# EAGLE design boxcar-v4a (EAGLE 5.10)
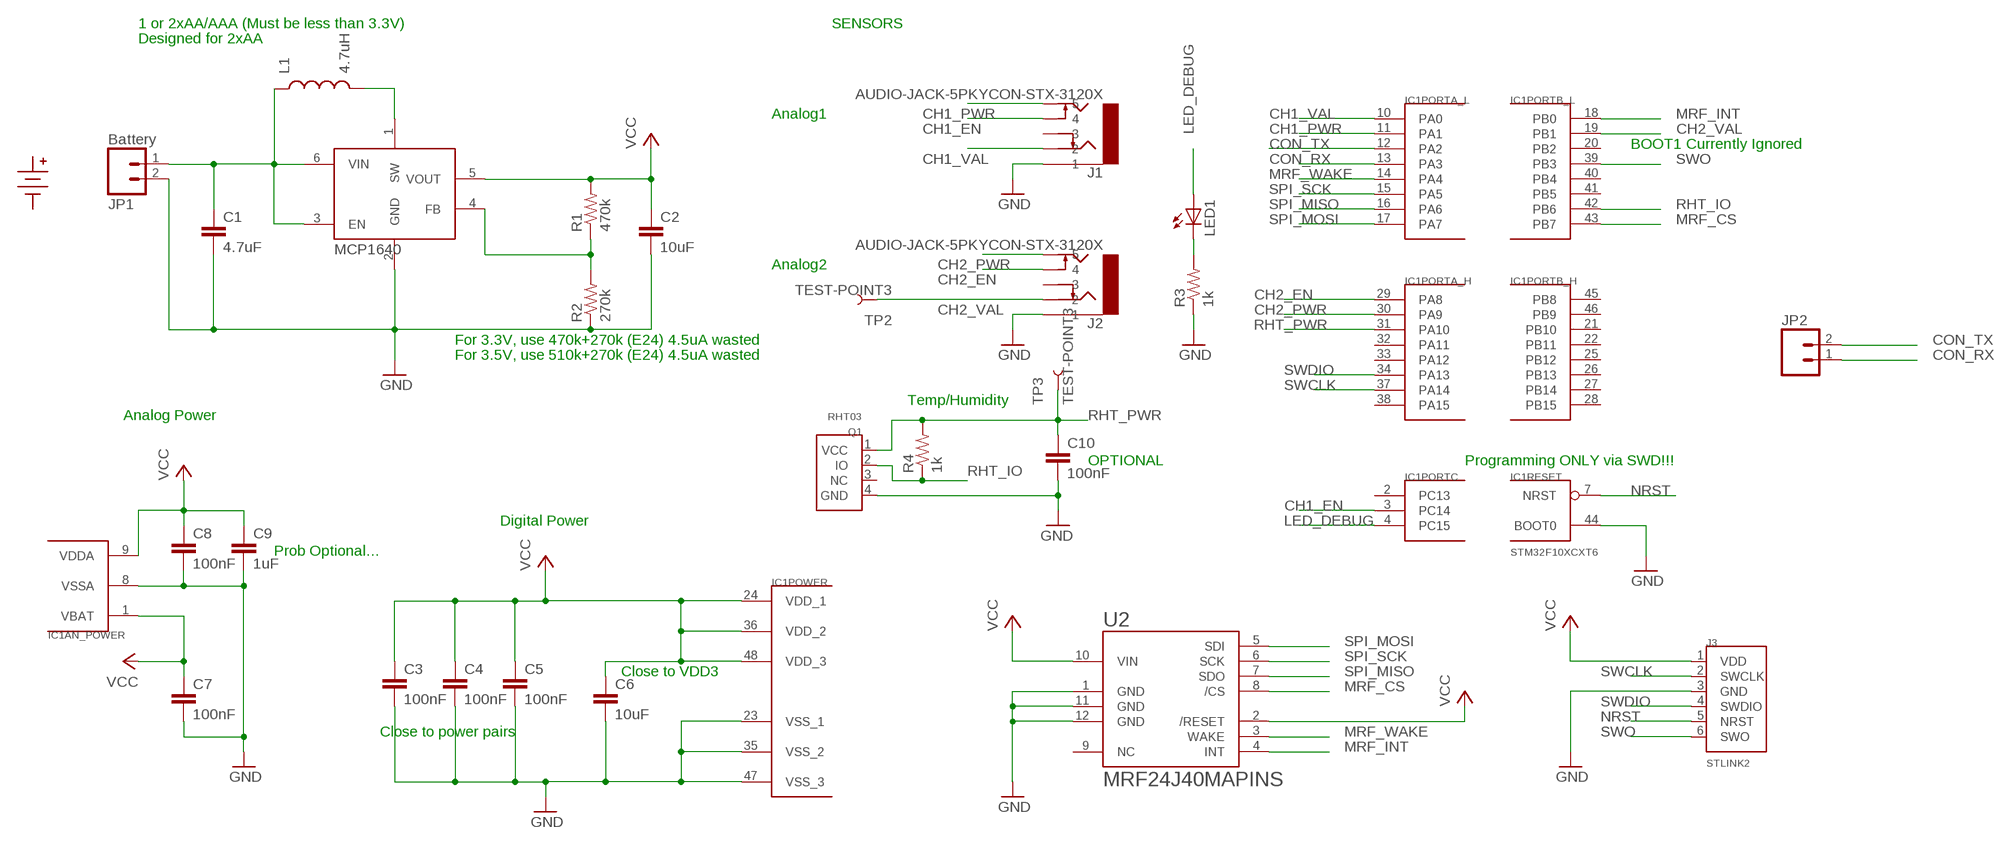
[diagram p0: schematic, sheet 1]

## Parts
C1  4.7uF  CAP0805  [0805]
C2  10uF  CAP0805  [0805]
C3  100nF  CAP0805  [0805]
C4  100nF  CAP0805  [0805]
C5  100nF  CAP0805  [0805]
C6  10uF  CAP0805  [0805]
C7  100nF  CAP0805  [0805]
C8  100nF  CAP0805  [0805]
C9  1uF  CAP0805  [0805]
C10  100nF  CAP0805  [0805]
IC1  STM32F10XCXT6  [TQFP48]
J1  AUDIO-JACK-5PKYCON-STX-3120X  [KYCON-STX-3120X]
J2  AUDIO-JACK-5PKYCON-STX-3120X  [KYCON-STX-3120X]
J3  STLINK2  [STLINK2]
JP1  Battery  M02PTH  [1X02]
JP2  M02PTH  [1X02]
L1  4.7uH  INDUCTOR0805  [0805]
LED1  LEDCHIPLED_0805  [CHIPLED_0805]
Q1  RHT03  [RHT03]
R1  470k  RESISTOR0805-RES  [0805]
R2  270k  RESISTOR0805-RES  [0805]
R3  1k  RESISTOR0805-RES  [0805]
R4  1k  RESISTOR0805-RES  [0805]
TP2  TEST-POINT3  [PAD.03X.03]
TP3  TEST-POINT3  [PAD.03X.03]
U1  MCP1640  [SOT23-6]
U2  MRF24J40MAPINS  [MRF24J40MA]
U$1  BATTERY_LEADS  [KEYSTONE-2463]

## Nets
BAT+: C1.1 JP1.1 L1.1 U1.3(EN) U1.6(VIN)
CH1_EN: IC1.3(PORTC:PC14) J1.4
CH1_PWR: IC1.11(PORTA_L:PA1) J1.5
CH1_VAL: IC1.10(PORTA_L:PA0) J1.2
CH2_EN: IC1.29(PORTA_H:PA8) J2.4
CH2_PWR: IC1.30(PORTA_H:PA9) J2.5
CH2_VAL: IC1.19(PORTB_L:PB1) J2.2 TP2.P$1
CON_RX: IC1.13(PORTA_L:PA3) JP2.1
CON_TX: IC1.12(PORTA_L:PA2) JP2.2
GND: C1.2 C2.2 C3.2 C4.2 C5.2 C6.2 C7.2 C8.2 C9.2 C10.2 IC1.8(AN_POWER:VSSA) IC1.23(POWER:VSS_1) IC1.35(POWER:VSS_2) IC1.44(RESET:BOOT0) IC1.47(POWER:VSS_3) J1.1 J2.1 J3.3(GND) JP1.2 Q1.4(GND) R2.1 R3.1 U1.2(GND) U2.1(GND) U2.11(GND) U2.12(GND)
LED_DEBUG: IC1.4(PORTC:PC15) LED1.A
MRF_CS: IC1.43(PORTB_L:PB7) U2.8(/CS)
MRF_INT: IC1.18(PORTB_L:PB0) U2.4(INT)
MRF_WAKE: IC1.14(PORTA_L:PA4) U2.3(WAKE)
N$1: L1.2 U1.1(SW)
N$3: LED1.C R3.2
N$4: R1.1 R2.2 U1.4(FB)
NRST: IC1.7(RESET:NRST) J3.5(NRST)
RHT_IO: IC1.42(PORTB_L:PB6) Q1.2(IO) R4.1
RHT_PWR: C10.1 IC1.31(PORTA_H:PA10) Q1.1(VCC) R4.2 TP3.P$1
SPI_MISO: IC1.16(PORTA_L:PA6) U2.7(SDO)
SPI_MOSI: IC1.17(PORTA_L:PA7) U2.5(SDI)
SPI_SCK: IC1.15(PORTA_L:PA5) U2.6(SCK)
SWCLK: IC1.37(PORTA_H:PA14) J3.2(SWCLK)
SWDIO: IC1.34(PORTA_H:PA13) J3.4(SWDIO)
SWO: IC1.39(PORTB_L:PB3) J3.6(SWO)
VCC: C2.1 C3.1 C4.1 C5.1 C6.1 C7.1 C8.1 C9.1 IC1.1(AN_POWER:VBAT) IC1.9(AN_POWER:VDDA) IC1.24(POWER:VDD_1) IC1.36(POWER:VDD_2) IC1.48(POWER:VDD_3) J3.1(VDD) R1.2 U1.5(VOUT) U2.2(/RESET) U2.10(VIN)
Unconnected: IC1.2(PORTC:PC13) IC1.5(PORTD/OSC:PD0/OSC<=) IC1.6(PORTD/OSC:PD1/OSC=>) IC1.20(PORTB_L:PB2) IC1.21(PORTB_H:PB10) IC1.22(PORTB_H:PB11) IC1.25(PORTB_H:PB12) IC1.26(PORTB_H:PB13) IC1.27(PORTB_H:PB14) IC1.28(PORTB_H:PB15) IC1.32(PORTA_H:PA11) IC1.33(PORTA_H:PA12) IC1.38(PORTA_H:PA15) IC1.40(PORTB_L:PB4) IC1.41(PORTB_L:PB5) IC1.45(PORTB_H:PB8) IC1.46(PORTB_H:PB9) J1.3 J2.3 Q1.3(NC) U2.9(NC)

## Notes on the sheet
- 1 or 2xAA/AAA (Must be less than 3.3V) | SENSORS
- Designed for 2xAA
- Analog1
- BOOT1 Currently Ignored
- Analog2
- For 3.3V, use 470k+270k (E24) 4.5uA wasted
- For 3.5V, use 510k+270k (E24) 4.5uA wasted
- Temp/Humidity
- Analog Power
- OPTIONAL | Programming ONLY via SWD!!!
- Digital Power
- Prob Optional...
- Close to VDD3
- Close to power pairs

## Library data of the parts
C1-C10 = SparkFun:CAP: Capacitor Standard 0603 ceramic capacitor, and 0.1" leaded capacitor.
IC1 = stm32:STM32F10XCXT6: ST STM32F101/103 48pin LQFP
J1 J2 = karlnet-parts:AUDIO-JACK-5P: Stereo Audio Jack, with switches for each signal contact
J3 = karlnet-parts:STLINK2: STLink/v2 connector 6 pin inline header for SWD, as used on STM32 Discovery boards. (Except the 32VL discovery board, which only has the top 4 pins)
JP1 JP2 = SparkFun:M02: Header 2 Standard 2-pin 0.1" header. Use with straight break away headers (SKU : PRT-00116), right angle break away headers (PRT-00553), swiss pins (PRT-00743), machine pins (PRT-00117), and female headers (PRT-00115). Molex polarized connector foot print use with SKU : PRT-08233 with associated crimp pins and housings.
L1 = SparkFun:INDUCTOR: Inductors Basic Inductor/Choke - 0603 and 1206. Footprints are not proven and vary greatly between part numbers.
LED1 = led:LED: LED OSRAM: - CHIPLED LG R971, LG N971, LY N971, LG Q971, LY Q971, LO R971, LY R971 LH N974, LH R974 LS Q976, LO Q976, LY Q976 LO Q996 - Hyper CHIPLED LW Q18S LB Q993, LB Q99A, LB R99A - SideLED LS A670, LO A670, LY A670, LG A670, LP A670 LB A673, LV A673, LT A673, LW A673 LH A674 LY A675 LS A676, LA A676, LO A676, LY A676, LW A676 LS A679, LY A679, LG A679 - Hyper Micro SIDELED® LS Y876, LA Y876, LO Y876, LY Y876 LT Y87S - SmartLED LW L88C, LW L88S LB L89C, LB L89S, LG L890 LS L89K, LO L89K, LY L89K LS L896, LA L896, LO L896, LY L896 - TOPLED LS T670, LO T670, LY T670, LG T670, LP T670 LSG T670, LSP T670, LSY T670, LOP T670, LYG T670 LG T671, LOG T671, LSG T671 LB T673, LV T673, LT T673, LW T673 LH T674 LS T676, LA T676, LO T676, LY T676, LB T676, LH T676, LSB T676, LW T676 LB T67C, LV T67C, LT T67C, LS T67K, LO T67K, LY T67K, LW E67C LS E67B, LA E67B, LO E67B, LY E67B, LB E67C, LV E67C, LT E67C LW T67C LS T679, LY T679, LG T679 LS T770, LO T770, LY T770, LG T770, LP T770 LB T773, LV T773, LT T773, LW T773 LH T774 LS E675, LA E675, LY E675, LS T675 LS T776, LA T776, LO T776, LY T776, LB T776 LHGB T686 LT T68C, LB T68C - Hyper Mini TOPLED® LB M676 - Mini TOPLED Santana® LG M470 LS M47K, LO M47K, LY M47K Source: http://www.osram.convergy.de LUXEON: - LUMILED® LXK2-PW12-R00, LXK2-PW12-S00, LXK2-PW14-U00, LXK2-PW14-V00 LXK2-PM12-R00, LXK2-PM12-S00, LXK2-PM14-U00 LXK2-PE12-Q00, LXK2-PE12-R00, LXK2-PE12-S00, LXK2-PE14-T00, LXK2-PE14-U00 LXK2-PB12-K00, LXK2-PB12-L00, LXK2-PB12-M00, LXK2-PB14-N00, LXK2-PB14-P00, LXK2-PB14-Q00 LXK2-PR12-L00, LXK2-PR12-M00, LXK2-PR14-Q00, LXK2-PR14-R00 LXK2-PD12-Q00, LXK2-PD12-R00, LXK2-PD12-S00 LXK2-PH12-R00, LXK2-PH12-S00 LXK2-PL12-P00, LXK2-PL12-Q00, LXK2-PL12-R00 Source: www.luxeon.com KINGBRIGHT: KA-3528ASYC Source: www.kingbright.com
Q1 = karlnet-parts:RHT03: RHT03 Temperature/Humidity sensor Also known as DHT22 and AM2302 Utilises a proprietary single pin interface. Occasionally reported to have pin 3 and 4 swapped (NC and ground) See also Sparkfun product page <http://www.sparkfun.com/products/10167>
R1-R4 = SparkFun:RESISTOR: Resistor Basic schematic elements and footprints for 0603, 1206, and PTH resistors.
TP2 TP3 = SparkFun:TEST-POINT
U1 = karlnet-parts:MCP1640: MCP1623, 1624, 1640/B/C/D pwm/pfm or pwm only DC/DC converters, in SOT-23
U2 = karlnet-parts:MRF24J40MA: MRF24J40MA module, 802.15.4 from microchip.
U$1 = karlnet-parts:BATTERY_LEADS: Battery holders with leads, ie, mechanical placement only, no electrical connections

## Board
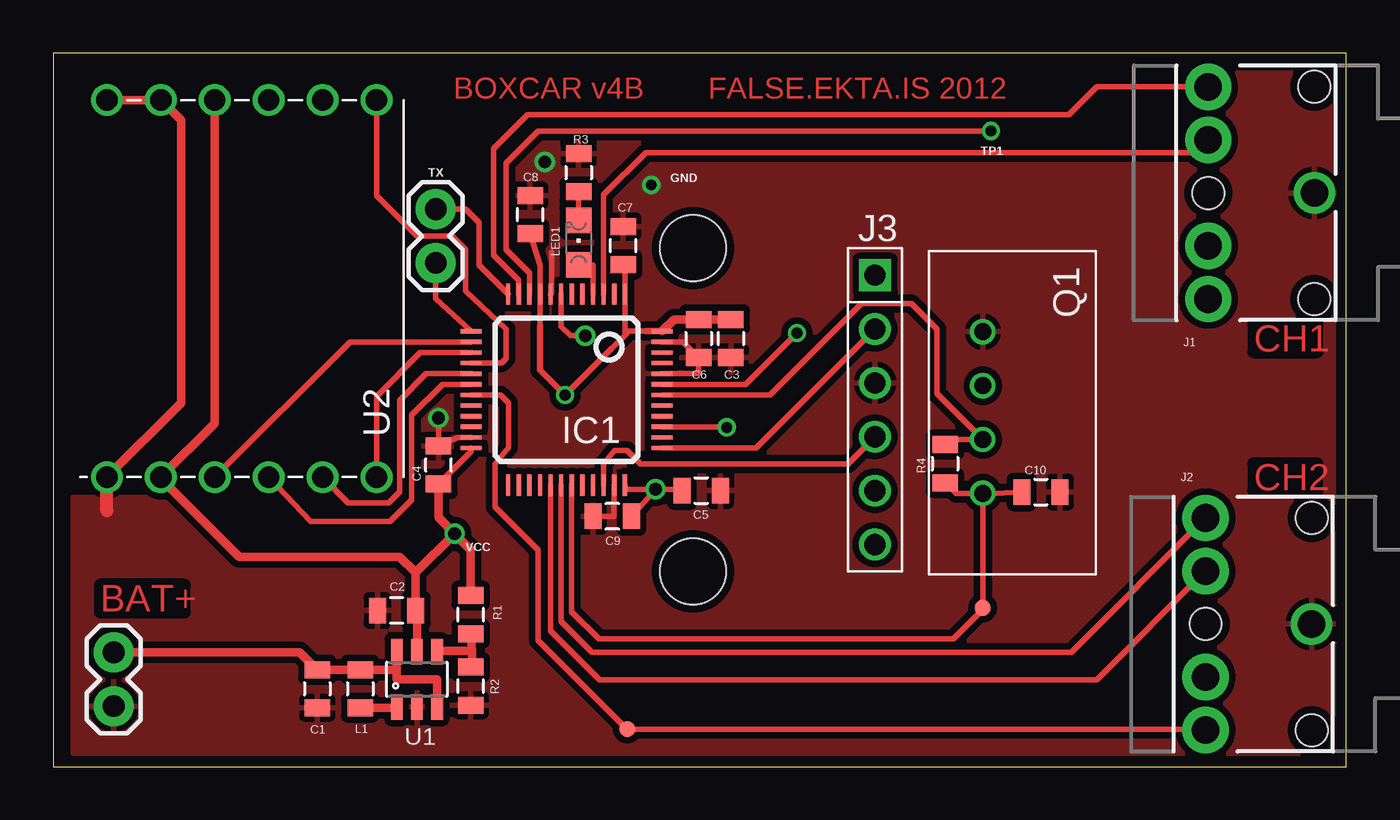
[diagram p1: board, top side]
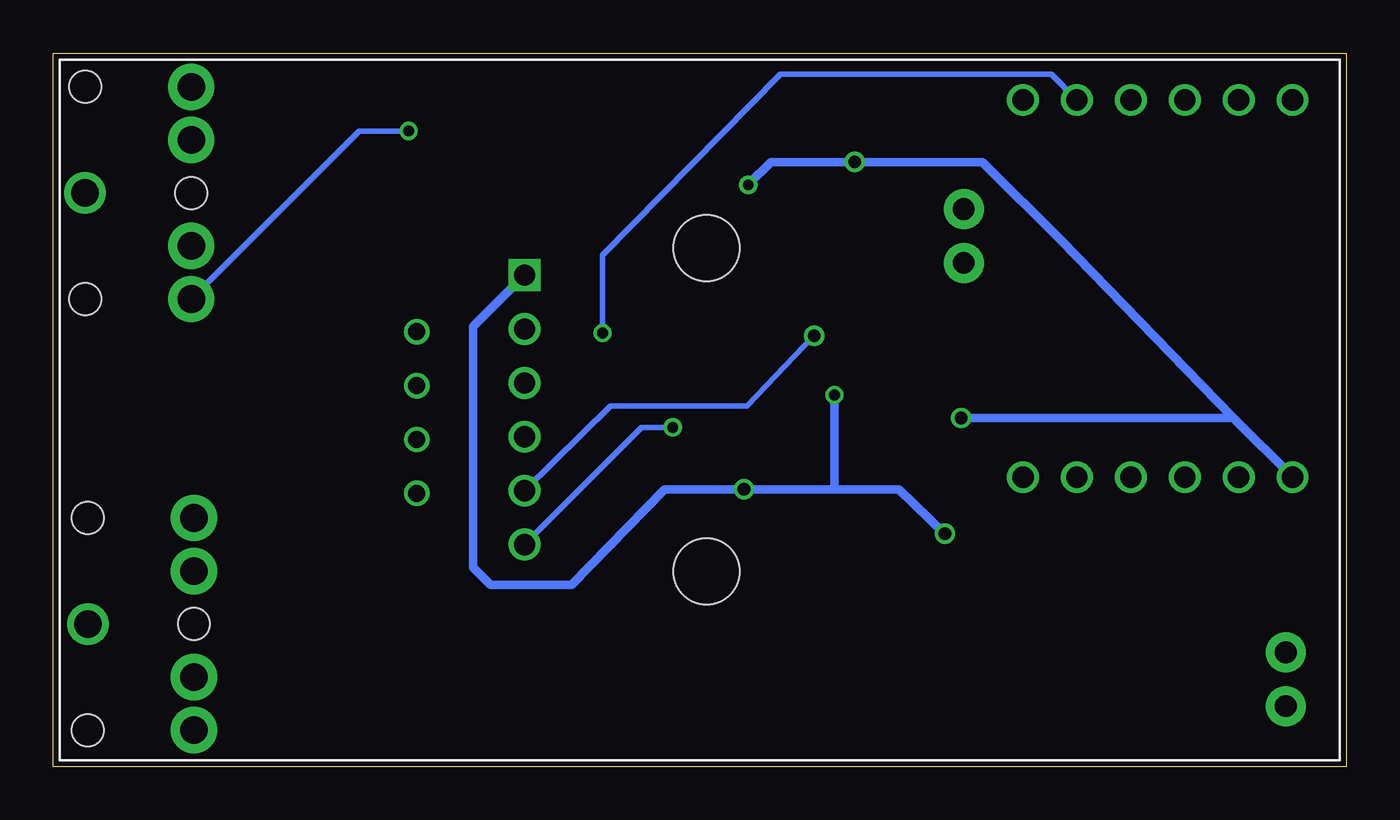
[diagram p2: board, bottom side, seen from below]

Size 60.95 x 33.65 mm. Coordinates in mm from the lower left corner, seen from the top.
Outline: 0,0 60.95,0 60.95,33.65 0,33.65 0,0
Copper layers (1*16): Top 0.0356mm / dielectric 1.5011mm / Bottom 0.0356mm
Design rules "LaenPCBOrder": minimum track width 6mil, minimum drill 13mil, track to track 6mil, track to pad 6mil, pad to pad 6mil, via to via 6mil, smd to smd 6mil, copper to edge 15mil, drill to drill 6mil, minimum pad ring 7mil, minimum via ring 7mil, stop-mask expansion 4mil, vias tented up to drill 0mil, thermal gap 10mil

### Footprints (pad centres in the part's own frame; a part is rotated, then mirrored left to right if it is on the bottom)
0805 = smd 0.8 x 1.2: 1 -0.9,0; 2 0.9,0
TQFP48 = smd 0.2 x 1: 1 -2.75,-4.5; 2 -2.25,-4.5; 3 -1.75,-4.5; 4 -1.25,-4.5; 5 -0.75,-4.5; 6 -0.25,-4.5; 7 0.25,-4.5; 8 0.75,-4.5; 9 1.25,-4.5; 10 1.75,-4.5; 11 2.25,-4.5; 12 2.75,-4.5; 25 2.75,4.5; 26 2.25,4.5; 27 1.75,4.5; 28 1.25,4.5; 29 0.75,4.5; 30 0.25,4.5; 31 -0.25,4.5; 32 -0.75,4.5; 33 -1.25,4.5; 34 -1.75,4.5; 35 -2.25,4.5; 36 -2.75,4.5 | smd 1 x 0.2: 13 4.5,-2.75; 14 4.5,-2.25; 15 4.5,-1.75; 16 4.5,-1.25; 17 4.5,-0.75; 18 4.5,-0.25; 19 4.5,0.25; 20 4.5,0.75; 21 4.5,1.25; 22 4.5,1.75; 23 4.5,2.25; 24 4.5,2.75; 37 -4.5,2.75; 38 -4.5,2.25; 39 -4.5,1.75; 40 -4.5,1.25; 41 -4.5,0.75; 42 -4.5,0.25; 43 -4.5,-0.25; 44 -4.5,-0.75; 45 -4.5,-1.25; 46 -4.5,-1.75; 47 -4.5,-2.25; 48 -4.5,-2.75
KYCON-STX-3120X = drill 1.3 round: 1 0,0 | drill 1.3 pad 2.184 round: 2 5,5; 3 5,2.5; 4 5,-2.5; 5 5,-5 | hole 1.5: 0,5; 0,-5; 5,0
STLINK2 = drill 1 square: 1 0,5.08 | drill 1 round: 2 0,2.54; 3 0,0; 4 0,-2.54; 5 0,-5.08; 6 0,-7.62
1X02 = drill 1.016 pad 1.88 round: 1 0,0; 2 2.54,0
CHIPLED_0805 = smd 1.2 x 1.2: A 0,-1.05; C 0,1.05
RHT03 = drill 0.8 round: 1 5.08,0; 2 2.54,0; 3 0,0; 4 -2.54,0
PAD.03X.03 = smd 0.762 x 0.762: P$1 0,0
SOT23-6 = smd 0.55 x 1.2: 1 -0.95,-1.3; 2 0,-1.3; 3 0.95,-1.3; 4 0.95,1.3; 5 0,1.3; 6 -0.95,1.3
MRF24J40MA = drill 1 round: 1 -8.89,12.7; 2 -8.89,10.16; 3 -8.89,7.62; 4 -8.89,5.08; 5 -8.89,2.54; 6 -8.89,0; 7 8.89,0; 8 8.89,2.54; 9 8.89,5.08; 10 8.89,7.62; 11 8.89,10.16; 12 8.89,12.7
KEYSTONE-2463 = hole 3.1: 29.845,8.89; 29.845,24.13

### Placement (x,y rotation side)
C1  12.45,3.68 270 top
C2  16.19,7.37 180 top
C3  31.94,20.19 270 top
C4  18.16,14.22 90 top
C5  30.54,13.02 0 top
C6  30.42,20.19 270 top
C7  26.86,24.57 90 top
C8  22.48,26.04 90 top
C9  26.35,11.81 180 top
C10  46.55,12.95 0 top
IC1  24.19,17.78 180 top
J1  59.44,27.05 180 top
J2  59.31,6.73 180 top
J3  38.73,18.1 0 top
JP1  2.86,5.4 270 top
JP2  18.03,23.75 90 top
L1  14.48,3.68 270 top
LED1  24.77,24.7 0 top
Q1  43.81,17.97 270 top
R1  19.68,7.18 90 top
R2  19.68,3.81 90 top
R3  24.77,28 270 top
R4  42.04,14.29 270 top
TP2  27.05,1.78 0 top
TP3  43.81,7.49 0 top
U1  17.14,4.13 0 top
U2  15.24,22.54 90 top
U$1  0.32,0.32 0 top

### Tracks (layer width: path | path; a pad name or v marks a point on that pad's centre or on a via)
BAT+
  Top 0.406: 16.2,4.57 16.2,4.13 18.09,4.13 U1.3 | 16.2,4.57 U1.6 | 16.2,4.57 16.18,4.58 L1.1 C1.1 11.63,5.4 JP1.1
CH1_EN
  Top 0.254: IC1.3 25.94,26.96 27.94,28.96 53.84,28.96 J1.4
CH1_PWR
  Top 0.254: IC1.11 21.94,22.95 20.77,24.13 20.77,29.15 22.35,30.73 47.88,30.73 49.2,32.05 J1.5
CH1_VAL  (via drill 0.51)
  Top 0.254: IC1.10 22.44,23.28 21.34,24.38 21.34,28.45 22.86,29.97 v44.2,29.97
  Bottom 0.254: J1.2 46.52,29.97 v44.2,29.97
CH2_EN
  Top 0.254: IC1.29 23.44,6.4 25.74,4.1 49.18,4.1 J2.4
CH2_PWR
  Top 0.254: IC1.30 23.94,6.85 25.4,5.4 47.98,5.4 J2.5
CH2_VAL
  Top 0.254: IC1.19 21.08,17.53 21.46,17.14 21.46,15.05 20.83,14.29 20.83,12.26 22.86,10.22 22.86,5.97 TP2.P$1 54.26,1.78 J2.2
CON_RX
  Top 0.254: IC1.13 18.03,22.06 JP2.1
CON_TX
  Top 0.254: JP2.2 19.43,26.29 20.07,25.65 20.07,23.66 IC1.12
GND  (via drill 0.51 pad 0.41, 0.6 pad 0.41)
  Top 0.254: IC1.23 19.07,15.53 C4.2 v18.16,16.45 | IC1.35 26.44,11.81 C9.2 | IC1.47 29.68,20.03 C6.2 30.42,18.53 IC1.44 | IC1.8 23.5,22.33 23.5,24.26
  Top 0.406: U2.1 6.03,17.14 6.03,30.48 U2.11 U2.12
  Top 0.61: 2.54,12.06 U2.1
  Bottom 0.406: 5.33,16.45 v18.16,16.45 | U2.1 5.33,16.45 | 5.33,16.45 13.46,24.83 17.14,28.51 v23.18,28.51 27.11,28.51 v28.19,27.43
  pour Top (isolate 0.305): 0.95,12.7 17.14,12.7 17.14,32.7 60.33,32.7 60.33,0.64 0.95,0.64
LED_DEBUG
  Top 0.254: IC1.4 25.44,23.65 LED1.A
MRF_CS  (via drill 0.51)
  Top 0.254: v35.05,20.45 32.63,18.03 IC1.43
  Bottom 0.254: U2.8 13.91,32.64 26.67,32.64 35.05,24.13 v35.05,20.45
MRF_INT
  Top 0.254: U2.4 12.13,11.56 15.88,11.56 16.89,12.57 16.89,16.57 18.35,18.03 IC1.18
MRF_WAKE
  Top 0.254: IC1.14 14,20.03 U2.3
N$1
  Top 0.406: L1.2 16.15,2.78 U1.1
N$3
  Top 0.254: LED1.C R3.2
N$4
  Top 0.406: R2.2 19.74,4.76 19.74,5.46 | 19.74,5.46 R1.1 | U1.4 18.13,5.46 19.74,5.46
NRST  (via drill 0.6 pad 0.41)
  Top 0.254: IC1.7 23.94,20.76 24.38,20.32 v25.08,20.32
  Bottom 0.254: v25.08,20.32 28.26,17.02 34.67,17.02 J3.5
RHT_IO
  Top 0.254: IC1.42 33.79,17.53 38.1,21.84 40.45,21.84 41.66,20.64 41.66,17.59 Q1.2 42.28,15.43 R4.1
RHT_PWR
  Top 0.254: IC1.31 24.44,7.31 25.72,6.03 42.42,6.03 43.81,7.43 TP3.P$1 Q1.1 | Q1.1 42.53,12.89 R4.2 | Q1.1 44.44,12.89 C10.1
SPI_MISO
  Top 0.254: IC1.16 21.12,19.03 21.34,19.24 21.34,20.64 19.43,22.42 19.43,24.38 18.8,25.02 17.14,25.02 15.24,26.92 U2.7
SPI_MOSI
  Top 0.254: U2.5 13.91,12.45 15.81,12.45 16.32,12.95 16.32,17.27 17.58,18.53 IC1.17
SPI_SCK
  Top 0.254: U2.6 15.24,17.46 17.31,19.53 IC1.15
SWCLK
  Top 0.254: IC1.37 33.13,15.03 J3.2
SWDIO
  Top 0.254: IC1.34 25.94,14.29 26.45,14.92 27.05,14.92 27.69,14.29 37.47,14.29 J3.4
SWO  (via drill 0.51)
  Top 0.254: IC1.39 31.72,16.03 v31.75,16
  Bottom 0.254: v31.75,16 33.21,16 J3.6
VCC  (via drill 0.51 pad 0.41, 0.6 pad 0.41)
  Top 0.254: C8.1 22.94,23.65 IC1.9 22.94,20.74 | C7.1 26.94,23.59 IC1.1 26.94,20.34 | IC1.36 26.94,13.08 v28.38,13.08 | v28.38,13.08 C9.1 | v28.38,13.08 29.64,13.08 C5.1 | IC1.24 19.69,14.86 C4.1 | 26.29,19.68 26.94,20.34 | 27.94,20.53 27.13,20.53 26.94,20.34
  Top 0.305: 27.94,20.53 IC1.48 | 22.94,20.74 22.94,18.71 v24.13,17.53 26.29,19.68
  Top 0.406: U2.10 7.62,16.19 U2.2 5.08,13.59 8.76,9.91 16.34,9.91 17.09,9.15 | 18.36,13.32 C4.1 18.16,11.75 v18.92,10.99 | C3.1 C6.1 29.26,21.09 IC1.48 | U1.5 17.14,7.31 arc90 C2.1 17.09,9.15 | R1.2 19.68,10.22 v18.92,10.99 | 17.09,9.15 v18.92,10.99
  Bottom 0.406: v18.92,10.99 21.08,13.08 24.13,13.08 | 24.13,13.08 v28.38,13.08 32.13,13.08 36.51,8.57 40.32,8.57 41.15,9.4 41.15,20.77 J3.1 | 24.13,13.08 v24.13,17.53

### Text on the board
Top: BOXCAR v4B | FALSE.EKTA.IS 2012 | CH1 | CH2 | BAT+
tPlace: TP1 | TX | GND | VCC